# Altium schematic sheet zab.odw.polar..SchDoc
size A4; SheetNumber: 5; SheetTotal: 7
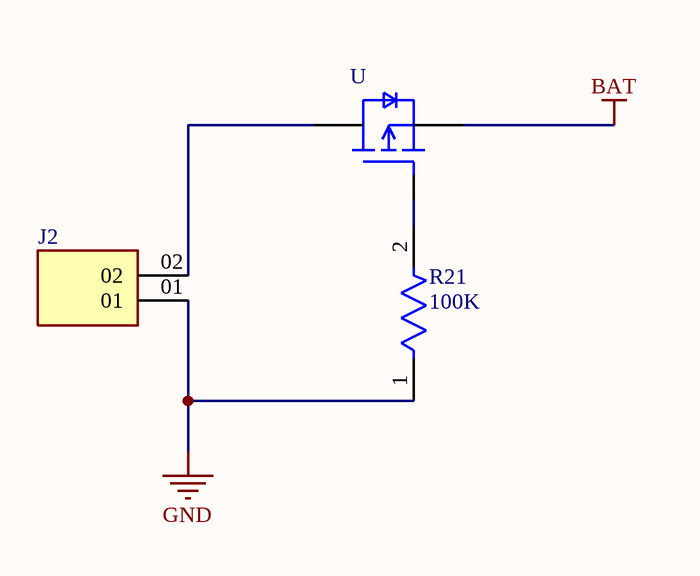
[diagram p0: zab.odw.polar..SchDoc]

## Parts
J2  HTSW-102-08-L-S  [SAMTEC_HTSW-102-08-L-S]  (value not drawn)
R21  100K  [FP-RC0805-0_6-IPC_C]
U  (no value)  [SOT23-3]

## Nets
BAT: U.2(S)
GND: J2.01 R21.1
NetJ2_02: J2.02 U.3(D)
NetR21_2: R21.2 U.1(G)

## Library data of the parts
J2 = HTSW-102-08-L-S: Conn Unshrouded Header HDR 2 POS 2.54mm Solder ST Top Entry Thru-Hole Bag; MF: Samtec Inc.; SnapEDA_Link: https://www.snapeda.com/parts/HTSW-102-08-L-S/Samtec/view-part/?ref=snap; Package: None; MP: HTSW-102-08-L-S; Check_prices: https://www.snapeda.com/parts/HTSW-102-08-L-S/Samtec/view-part/?ref=eda; Purchase-URL: https://pricing.snapeda.com/search/part/HTSW-102-08-L-S/?ref=eda; Price: None; Value: *; Availability: In Stock
R21 = CMP-2100-03668-5: RES 100K OHM 1% 1/8W 0805; Power Rating: 125mW; Temperature Coefficient: 100ppm/°C; Voltage Rating (DC): 150V; Resistance: 100kR; Package Quantity: 1; Case/Package: 0805; Lead Pitch: 0.4mm; Case Code (Imperial): 0805; Construction: Rectangular; Number of Terminations: 2; RoHS Compliant: Yes; Max Power Dissipation: 125mW; Tolerance: 1%; Max Operating Temperature: 155°C; Resistance Tolerance: 1%; Lead Free: Lead Free; Packaging: Tape and Reel; Resistor Type: Thick Film; Min Operating Temperature: -55°C; Case Code (Metric): 2012; Series: RC; Technology: THICK FILM; Voltage Rating: 150V; Termination: SMD/SMT; Width: 0.049inch; Number of Pins: 2; Features: Moisture Resistant; Military Standard: Not; Length: 0.079inch; Depth: 1.25mm; Size Code: 0805; Height: 0.024inch
U = AO3401: P-Channel 30V 4A (Ta) 1.4W (Ta) Surface Mount SOT-23-3L; MF: Alpha & Omega Semiconductor; Price: None; SnapEDA_Link: https://www.snapeda.com/parts/AO3401/Alpha%20&%20Omega%20Semiconductor/view-part/4795619/?ref=snap; Arrow_Electronics-Purchase-URL: https://snapeda.com/shop?store=Arrow+Electronics&id=4795619; Availability: Warning; MP: AO3401; Value: *; Package: SOT-23-3 Alpha &amp; Omega Semiconductor